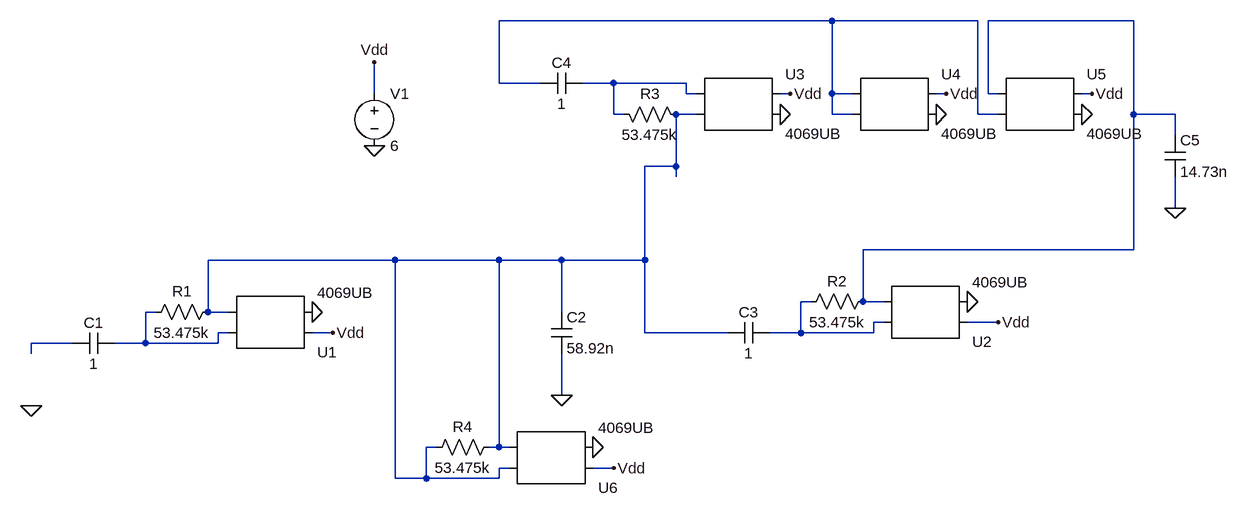
[diagram p0: schematic q2''''.asc]
q2''''.asc, the LTspice schematic file:
Version 4
SHEET 1 1196 680
WIRE 576 -144 64 -144
WIRE 800 -144 576 -144
WIRE 1040 -144 816 -144
WIRE 64 -48 64 -144
WIRE 128 -48 64 -48
WIRE 240 -48 192 -48
WIRE 352 -48 240 -48
WIRE -128 -32 -128 -80
WIRE 352 -32 352 -48
WIRE 368 -32 352 -32
WIRE 512 -32 496 -32
WIRE 576 -32 576 -144
WIRE 608 -32 576 -32
WIRE 752 -32 736 -32
WIRE 816 -32 816 -144
WIRE 832 -32 816 -32
WIRE 976 -32 960 -32
WIRE 240 0 240 -48
WIRE 256 0 240 0
WIRE 368 0 336 0
WIRE 576 0 576 -32
WIRE 608 0 576 0
WIRE 800 0 800 -144
WIRE 832 0 800 0
WIRE 1040 0 1040 -144
WIRE 1104 0 1040 0
WIRE 1104 32 1104 0
WIRE 336 80 336 0
WIRE 336 80 288 80
WIRE 336 96 336 80
WIRE 1104 144 1104 96
WIRE 1040 208 1040 0
WIRE 1040 208 624 208
WIRE -96 224 -384 224
WIRE 64 224 -96 224
WIRE 160 224 64 224
WIRE 288 224 288 80
WIRE 288 224 160 224
WIRE 544 288 528 288
WIRE 624 288 624 208
WIRE 656 288 624 288
WIRE -464 304 -480 304
WIRE -384 304 -384 224
WIRE -352 304 -384 304
WIRE 160 304 160 224
WIRE 656 320 640 320
WIRE 832 320 784 320
WIRE -352 336 -368 336
WIRE -192 336 -224 336
WIRE 288 336 288 224
WIRE 416 336 288 336
WIRE 528 336 528 288
WIRE 528 336 480 336
WIRE 640 336 640 320
WIRE 640 336 528 336
WIRE -592 352 -656 352
WIRE -480 352 -480 304
WIRE -480 352 -528 352
WIRE -368 352 -368 336
WIRE -368 352 -480 352
WIRE -656 368 -656 352
WIRE 160 432 160 368
WIRE -32 512 -48 512
WIRE 64 512 64 224
WIRE 64 512 48 512
WIRE 80 512 64 512
WIRE 80 544 64 544
WIRE 240 544 208 544
WIRE -96 560 -96 224
WIRE -48 560 -48 512
WIRE -48 560 -96 560
WIRE 64 560 64 544
WIRE 64 560 -48 560
FLAG -224 304 0
FLAG -656 448 0
FLAG 160 432 0
FLAG 784 288 0
FLAG 496 0 0
FLAG 736 0 0
FLAG 960 0 0
FLAG -128 48 0
FLAG -128 -80 Vdd
FLAG 752 -32 Vdd
FLAG 512 -32 Vdd
FLAG 976 -32 Vdd
FLAG 832 320 Vdd
FLAG -192 336 Vdd
FLAG 1104 144 0
FLAG 208 512 0
FLAG 240 544 Vdd
SYMBOL AutoGenerated\\4069UB -288 320 M180
SYMATTR InstName U1
SYMBOL cap -528 336 R90
WINDOW 0 0 32 VBottom 2
WINDOW 3 32 32 VTop 2
SYMATTR InstName C1
SYMATTR Value 1
SYMBOL res -368 288 R90
WINDOW 0 0 56 VBottom 2
WINDOW 3 32 56 VTop 2
SYMATTR InstName R1
SYMATTR Value 53.475k
SYMBOL cap 144 304 R0
SYMATTR InstName C2
SYMATTR Value 58.92n
SYMBOL AutoGenerated\\4069UB 720 304 M180
SYMATTR InstName U2
SYMBOL cap 480 320 R90
WINDOW 0 0 32 VBottom 2
WINDOW 3 32 32 VTop 2
SYMATTR InstName C3
SYMATTR Value 1
SYMBOL res 640 272 R90
WINDOW 0 0 56 VBottom 2
WINDOW 3 32 56 VTop 2
SYMATTR InstName R2
SYMATTR Value 53.475k
SYMBOL AutoGenerated\\4069UB 432 -16 R0
SYMATTR InstName U3
SYMBOL cap 192 -32 M270
WINDOW 0 32 32 VTop 2
WINDOW 3 0 32 VBottom 2
SYMATTR InstName C4
SYMATTR Value 1
SYMBOL res 352 16 M270
WINDOW 0 32 56 VTop 2
WINDOW 3 0 56 VBottom 2
SYMATTR InstName R3
SYMATTR Value 53.475k
SYMBOL AutoGenerated\\4069UB 672 -16 R0
SYMATTR InstName U4
SYMBOL AutoGenerated\\4069UB 896 -16 R0
SYMATTR InstName U5
SYMBOL voltage -128 -48 R0
SYMATTR InstName V1
SYMATTR Value 6
SYMBOL cap 1088 32 R0
SYMATTR InstName C5
SYMATTR Value 14.73n
SYMBOL AutoGenerated\\4069UB 144 528 M180
SYMATTR InstName U6
SYMBOL res 64 496 R90
WINDOW 0 0 56 VBottom 2
WINDOW 3 32 56 VTop 2
SYMATTR InstName R4
SYMATTR Value 53.475k

The netlist it stands for:
* q2''''.asc
* U1: 4069UB (symbol AutoGenerated\4069UB not available, pins judged from their places): pin1=N006 pin2=N004 pin3=Vdd pin4=0
C1 N006 N007 1
R1 N004 N006 53.475k
C2 N004 0 58.92n
* U2: 4069UB (symbol AutoGenerated\4069UB not available, pins judged from their places): pin1=N005 pin2=N002 pin3=Vdd pin4=0
C3 N005 N004 1
R2 N002 N005 53.475k
* U3: 4069UB (symbol AutoGenerated\4069UB not available, pins judged from their places): pin1=N003 pin2=N004 pin3=Vdd pin4=0
C4 N003 N001 1
R3 N004 N003 53.475k
* U4: 4069UB (symbol AutoGenerated\4069UB not available, pins judged from their places): pin1=N001 pin2=N001 pin3=Vdd pin4=0
* U5: 4069UB (symbol AutoGenerated\4069UB not available, pins judged from their places): pin1=N002 pin2=N001 pin3=Vdd pin4=0
V1 Vdd 0 6
C5 N002 0 14.73n
* U6: 4069UB (symbol AutoGenerated\4069UB not available, pins judged from their places): pin1=N004 pin2=N004 pin3=Vdd pin4=0
R4 N004 N004 53.475k
.backanno
.end